# Altium schematic sheet 32-S297connection.SchDoc
size A4
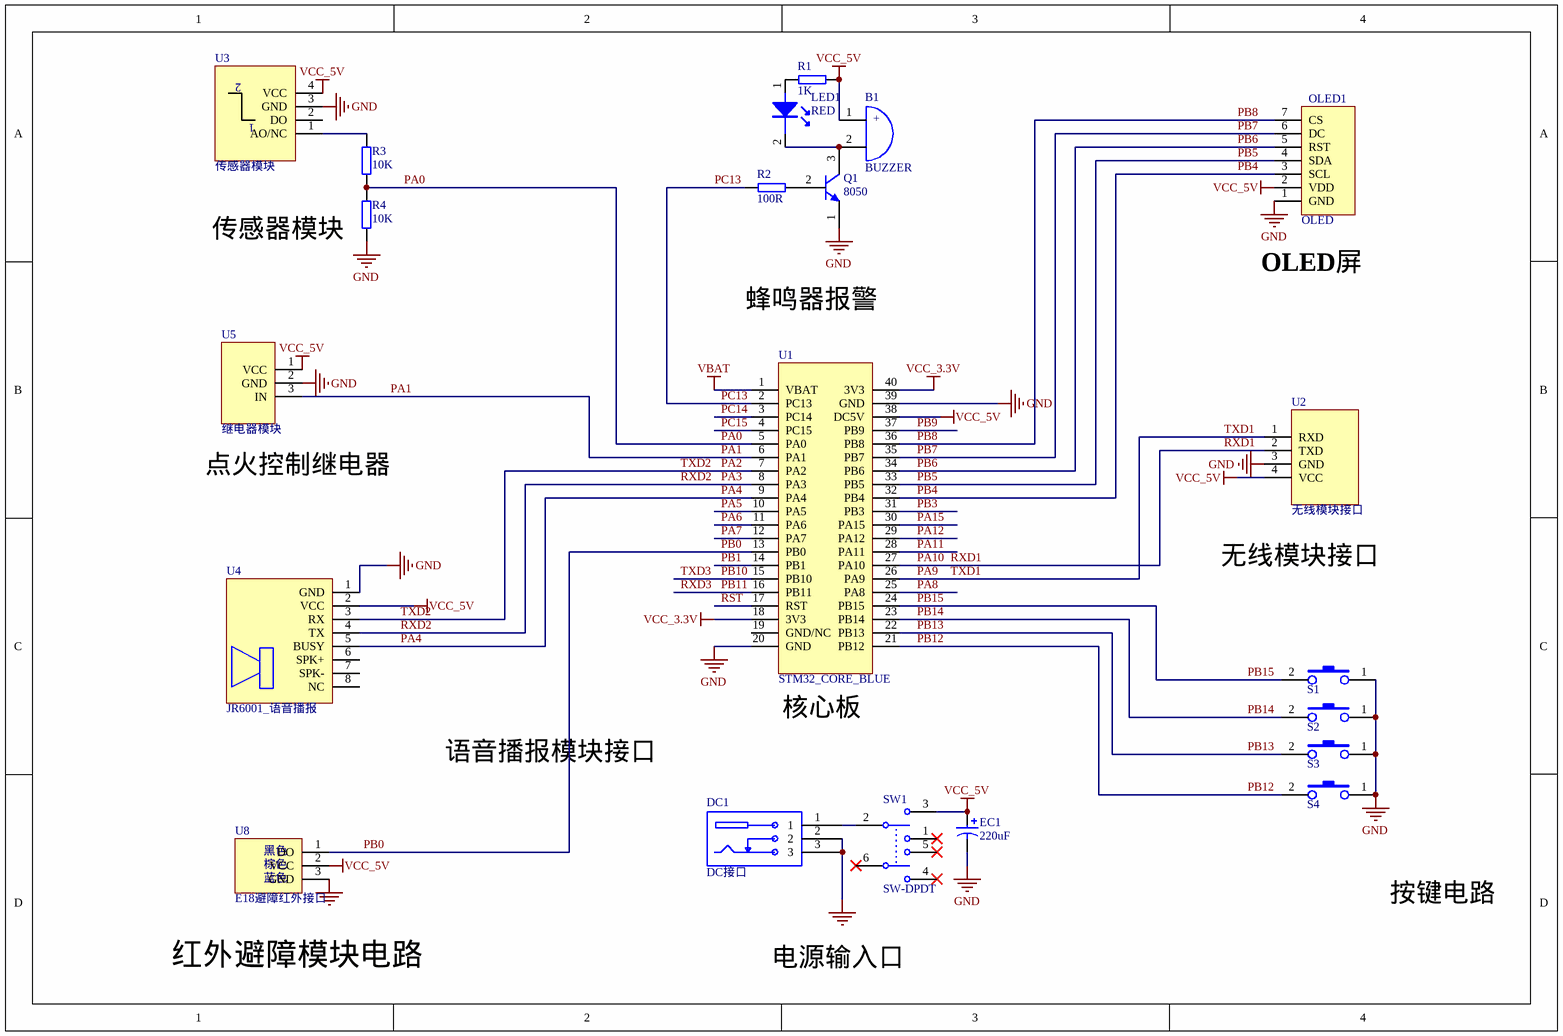
[diagram p0: 32-S297connection.SchDoc]

## Parts
B1  BUZZER  [BUZZERSOT_PLASTIC]
DC1  DC接口  [DC-JACK-002]
EC1  220uF  [RB.15/.3]
LED1  RED  [LED_D3MM12]
OLED1  OLED  [OLED_0_96]
Q1  8050  [TO-92]
R1  1K  [AXIAL0.3]
R2  100R  [AXIAL0.3]
R3  10K  [AXIAL0.3]
R4  10K  [AXIAL0.3]
S1  BUTTOM  [BUTTON_6x6DIP]  (value not drawn)
S2  BUTTOM  [BUTTON_6x6DIP]  (value not drawn)
S3  BUTTOM  [BUTTON_6x6DIP]  (value not drawn)
S4  BUTTOM  [BUTTON_6x6DIP]  (value not drawn)
SW1  SW-DPDT  [SW]
U1  STM32_CORE_BLUE  [STM32_CORE_BLUE]
U2  无线模块接口  [蓝牙MODE竖放]
U3  传感器模块  [通用MODE竖放]
U4  JR6001_语音播报  [JR6001_语音播报]
U5  继电器模块  [继电器接口]
U8  E18避障红外接口  [红外接口]

## Nets
GND: DC1.2 DC1.3 EC1.2 OLED1.1(GND) Q1.1 R4.2 S1.1 S2.1 S3.1 S4.1 U1.20(GND) U1.39(GND) U2.3(GND) U3.3(GND) U4.1(GND) U5.2(GND) U8.3(GND)
VBAT: U1.1(VBAT)
VCC_3.3V: U1.18(3V3) U1.40(3V3)
VCC_5V: B1.1 EC1.1 OLED1.2(VDD) R1.1 SW1.3 U1.38(DC5V) U2.4(VCC) U3.4(VCC) U4.2(VCC) U5.1(VCC) U8.2(VCC)
PA0: R3.2 R4.1 U1.5(PA0)
PA1: U1.6(PA1) U5.3(IN)
PA2: U1.7(PA2) U4.3(RX)  [also labelled TXD2]
PA3: U1.8(PA3) U4.4(TX)  [also labelled RXD2]
PA4: U1.9(PA4) U4.5(BUSY)
PA5: U1.10(PA5)
PA6: U1.11(PA6)
PA7: U1.12(PA7)
PA8: U1.25(PA8)
PA9: U1.26(PA9) U2.1(RXD)  [also labelled TXD1]
PA10: U1.27(PA10) U2.2(TXD)  [also labelled RXD1]
PA11: U1.28(PA11)
PA12: U1.29(PA12)
PA15: U1.30(PA15)
PB0: U1.13(PB0) U8.1(DO)
PB1: U1.14(PB1)
PB3: U1.31(PB3)
PB4: OLED1.3(SCL) U1.32(PB4)
PB5: OLED1.4(SDA) U1.33(PB5)
PB6: OLED1.5(RST) U1.34(PB6)
PB7: OLED1.6(DC) U1.35(PB7)
PB8: OLED1.7(CS) U1.36(PB8)
PB9: U1.37(PB9)
PB10: U1.15(PB10)  [also labelled TXD3]
PB11: U1.16(PB11)  [also labelled RXD3]
PB12: S4.2 U1.21(PB12)
PB13: S3.2 U1.22(PB13)
PB14: S2.2 U1.23(PB14)
PB15: S1.2 U1.24(PB15)
PC13: R2.2 U1.2(PC13)
PC14: U1.3(PC14)
PC15: U1.4(PC15)
RST: U1.17(RST)
NetB1_2: B1.2 LED1.2 Q1.3
NetDC1_1: DC1.1 SW1.2
NetLED1_1: LED1.1 R1.2
NetQ1_2: Q1.2 R2.1
NetR3_1: R3.1 U3.1(AO/NC)

Not connected (* = marked no-connect by the designer): SW1 1* 4* 5* 6*; U1 19(GND/NC); U3 2(DO); U4 6(SPK+) 7(SPK-) 8(NC)

## Notes on the sheet
- 传感器模块
- 蜂鸣器报警
- (near OLED1) OLED屏
- 点火控制继电器
- 无线模块接口
- (near U1) 核心板
- (near U4) 语音播报模块接口
- 按键电路
- 红外避障模块电路
- 电源输入口
- (in symbol BUZZER) +
- (in symbol 避障红外接口) 黑色; 棕色; 蓝色

## Library data of the parts
B1 = BUZZER: 蜂鸣器
DC1 = DC接口: DC接口（分大小）
EC1 = CAP_EC: 极性电容
LED1 = LED: LED灯
OLED1 = OLED: OLED-0.96
Q1 = 9013: 三极管
R1-R4 = RES: 电阻
S1-S4 = BUTTOM: 按键
SW1 = SW-DPDT: 电源开关; Published: 24-Mar-1999; LatestRevisionDate: 17-Jul-2002; LatestRevisionNote: Re-released for DXP Platform.; PackageReference: DPDT-6; Publisher: Altium Limited
U2 = 蓝牙MODE: 预留串口
U3 = 土壤检测MODE: 土壤湿度模块
U8 = 避障红外接口: 避障红外探头模块